# EAGLE design PRY234 (EAGLE 8.3.2)
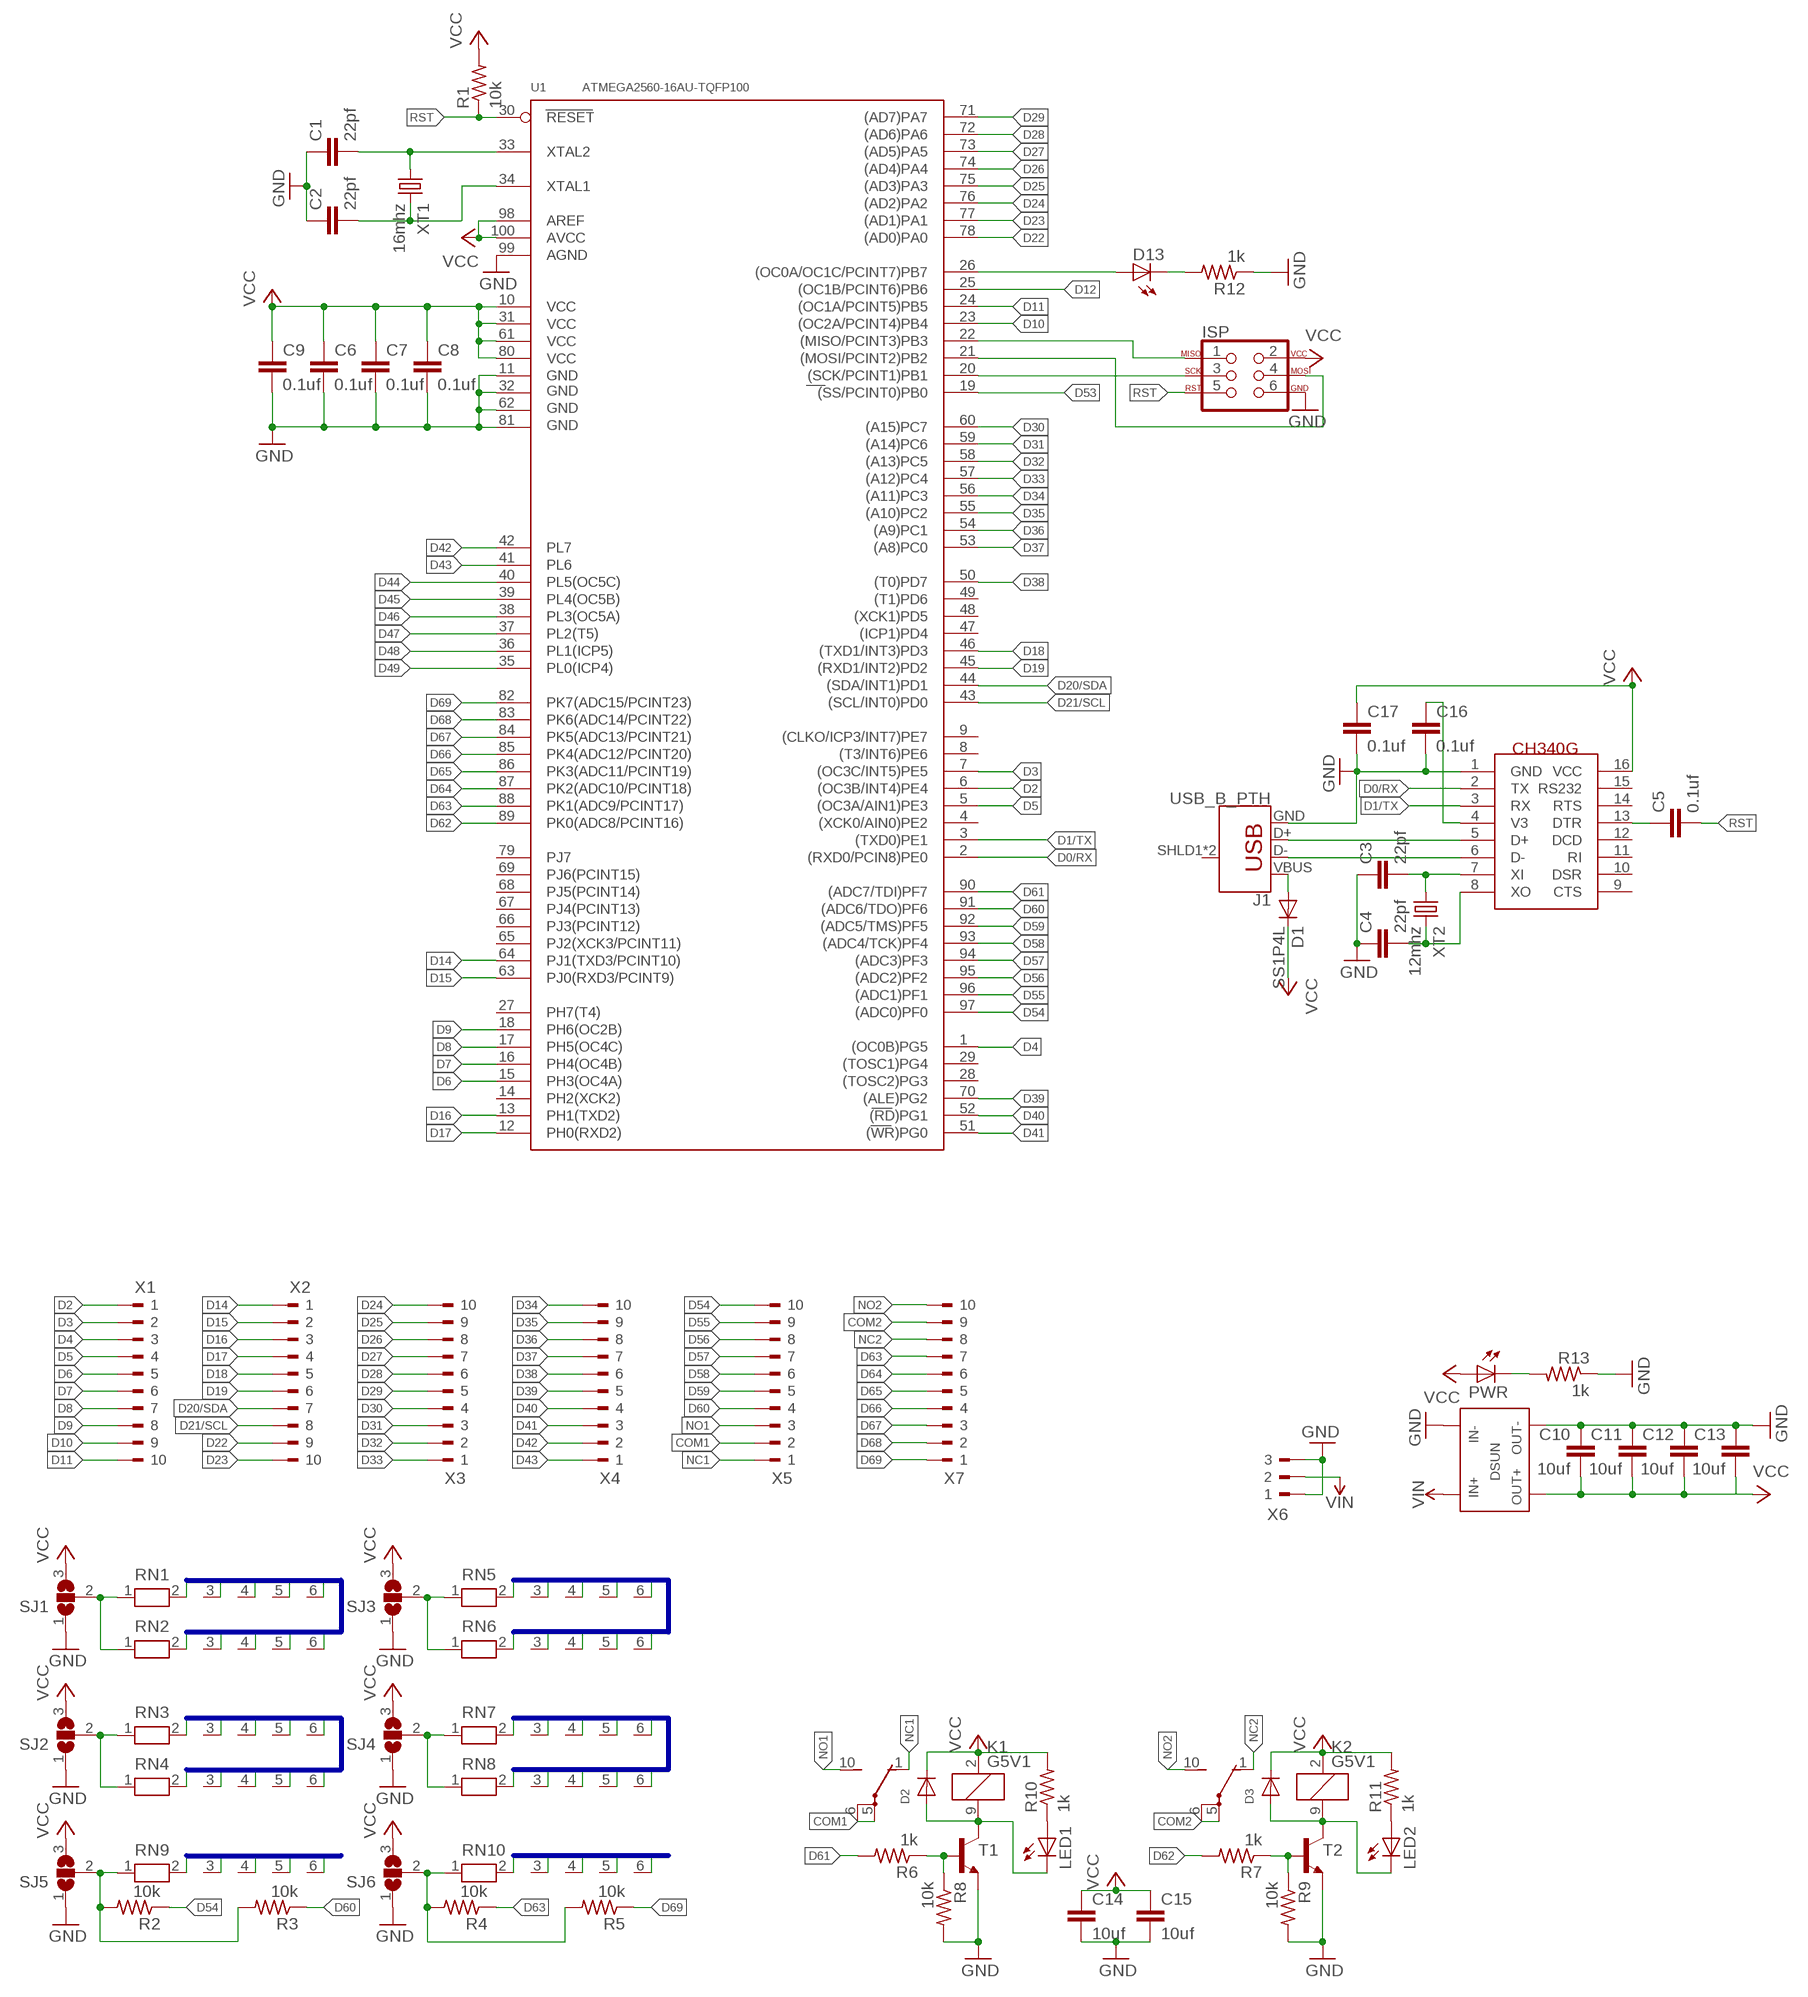
[diagram p0: schematic, sheet 1]

## Parts
C1  22pf  C-EUC0805  [C0805]
C2  22pf  C-EUC0805  [C0805]
C3  22pf  C-EUC0805  [C0805]
C4  22pf  C-EUC0805  [C0805]
C5  0.1uf  C-EUC0805  [C0805]
C6  0.1uf  C-EUC0805  [C0805]
C7  0.1uf  C-EUC0805  [C0805]
C8  0.1uf  C-EUC0805  [C0805]
C9  0.1uf  C-EUC0805  [C0805]
C10  10uf  C-EUC0805  [C0805]
C11  10uf  C-EUC0805  [C0805]
C12  10uf  C-EUC0805  [C0805]
C13  10uf  C-EUC0805  [C0805]
C14  10uf  C-EUC0805  [C0805]
C15  10uf  C-EUC0805  [C0805]
C16  0.1uf  C-EUC0805  [C0805]
C17  0.1uf  C-EUC0805  [C0805]
D1  SS1P4L  [DO220AAL]
D2  DIODESOD-323F  [SOD-323F]
D3  DIODESOD-323F  [SOD-323F]
D13  LEDCHIPLED_0805  [CHIPLED_0805]
ISP  AVR_SPI_PROG_3X2PTH  [2X3]
J1  USB_B_PTH  [USB-B-PTH]
K1  G5V1  [G5V1]
K2  G5V1  [G5V1]
LED1  LEDCHIPLED_0805  [CHIPLED_0805]
LED2  LEDCHIPLED_0805  [CHIPLED_0805]
PWR  LEDCHIPLED_0805  [CHIPLED_0805]
R1  10k  R-US_M0805  [M0805]
R2  10k  R-US_M0805  [M0805]
R3  10k  R-US_M0805  [M0805]
R4  10k  R-US_M0805  [M0805]
R5  10k  R-US_M0805  [M0805]
R6  1k  R-US_M0805  [M0805]
R7  1k  R-US_M0805  [M0805]
R8  10k  R-US_M0805  [M0805]
R9  10k  R-US_M0805  [M0805]
R10  1k  R-US_M0805  [M0805]
R11  1k  R-US_M0805  [M0805]
R12  1k  R-US_M0805  [M0805]
R13  1k  R-US_M0805  [M0805]
RN1  RN05  [RN-6]
RN2  RN05  [RN-6]
RN3  RN05  [RN-6]
RN4  RN05  [RN-6]
RN5  RN05  [RN-6]
RN6  RN05  [RN-6]
RN7  RN05  [RN-6]
RN8  RN05  [RN-6]
RN9  RN05  [RN-6]
RN10  RN05  [RN-6]
SJ1  SJ2W  [SJ_2]
SJ2  SJ2W  [SJ_2]
SJ3  SJ2W  [SJ_2]
SJ4  SJ2W  [SJ_2]
SJ5  SJ2W  [SJ_2]
SJ6  SJ2W  [SJ_2]
T1  MMBT2222ALT1-NPN-SOT23-BEC  [SOT23-BEC]
T2  MMBT2222ALT1-NPN-SOT23-BEC  [SOT23-BEC]
U1  ATMEGA2560-16AU-TQFP100  MCU-ATMEGA2560-16AU(TQFP100)  [TQFP100-0.5-14X14MM]
U$1  CH340G  [SOIC16]
U$3  DSUN  [DSUN]
X1  90-10  [90-10]
X2  90-10  [90-10]
X3  90-10  [90-10]
X4  90-10  [90-10]
X5  90-10  [90-10]
X6  90-3  [90-3]
X7  90-10  [90-10]
XT1  16mhz  XTAL7641  [XTAL7641]
XT2  12mhz  XTAL7641  [XTAL7641]

## Nets
COM1: K1.5(2:P) K1.6(2:P) X5.2
COM2: K2.5(2:P) K2.6(2:P) X7.9
D0/RX: U1.2((RXD0/PCIN8)PE0) U$1.2(TX)
D1/TX: U1.3((TXD0)PE1) U$1.3(RX)
D2: RN1.6 U1.6((OC3B/INT4)PE4) X1.1
D3: RN1.5 U1.7((OC3C/INT5)PE5) X1.2
D4: RN1.4 U1.1((OC0B)PG5) X1.3
D5: RN1.3 U1.5((OC3A/AIN1)PE3) X1.4
D6: RN1.2 U1.15(PH3(OC4A)) X1.5
D7: RN2.2 U1.16(PH4(OC4B)) X1.6
D8: RN2.3 U1.17(PH5(OC4C)) X1.7
D9: RN2.4 U1.18(PH6(OC2B)) X1.8
D10: RN2.5 U1.23((OC2A/PCINT4)PB4) X1.9
D11: RN2.6 U1.24((OC1A/PCINT5)PB5) X1.10
D12: U1.25((OC1B/PCINT6)PB6)
D14: RN3.6 U1.64(PJ1(TXD3/PCINT10)) X2.1
D15: RN3.5 U1.63(PJ0(RXD3/PCINT9)) X2.2
D16: RN3.4 U1.13(PH1(TXD2)) X2.3
D17: RN3.3 U1.12(PH0(RXD2)) X2.4
D18: RN3.2 U1.46((TXD1/INT3)PD3) X2.5
D19: RN4.2 U1.45((RXD1/INT2)PD2) X2.6
D20/SDA: RN4.3 U1.44((SDA/INT1)PD1) X2.7
D21/SCL: RN4.4 U1.43((SCL/INT0)PD0) X2.8
D22: RN4.5 U1.78((AD0)PA0) X2.9
D23: RN4.6 U1.77((AD1)PA1) X2.10
D24: RN5.6 U1.76((AD2)PA2) X3.10
D25: RN5.5 U1.75((AD3)PA3) X3.9
D26: RN5.4 U1.74((AD4)PA4) X3.8
D27: RN5.3 U1.73((AD5)PA5) X3.7
D28: RN5.2 U1.72((AD6)PA6) X3.6
D29: RN6.2 U1.71((AD7)PA7) X3.5
D30: RN6.3 U1.60((A15)PC7) X3.4
D31: RN6.4 U1.59((A14)PC6) X3.3
D32: RN6.5 U1.58((A13)PC5) X3.2
D33: RN6.6 U1.57((A12)PC4) X3.1
D34: RN7.6 U1.56((A11)PC3) X4.10
D35: RN7.5 U1.55((A10)PC2) X4.9
D36: RN7.4 U1.54((A9)PC1) X4.8
D37: RN7.3 U1.53((A8)PC0) X4.7
D38: RN7.2 U1.50((T0)PD7) X4.6
D39: RN8.2 U1.70((ALE)PG2) X4.5
D40: RN8.3 U1.52((RD)PG1) X4.4
D41: RN8.4 U1.51((WR)PG0) X4.3
D42: RN8.5 U1.42(PL7) X4.2
D43: RN8.6 U1.41(PL6) X4.1
D44: U1.40(PL5(OC5C))
D45: U1.39(PL4(OC5B))
D46: U1.38(PL3(OC5A))
D47: U1.37(PL2(T5))
D48: U1.36(PL1(ICP5))
D49: U1.35(PL0(ICP4))
D53: U1.19((SS/PCINT0)PB0)
D54: R2.1 U1.97((ADC0)PF0) X5.10
D55: RN9.6 U1.96((ADC1)PF1) X5.9
D56: RN9.5 U1.95((ADC2)PF2) X5.8
D57: RN9.4 U1.94((ADC3)PF3) X5.7
D58: RN9.3 U1.93((ADC4/TCK)PF4) X5.6
D59: RN9.2 U1.92((ADC5/TMS)PF5) X5.5
D60: R3.1 U1.91((ADC6/TDO)PF6) X5.4
D61: R6.2 U1.90((ADC7/TDI)PF7)
D62: R7.2 U1.89(PK0(ADC8/PCINT16))
D63: R4.1 U1.88(PK1(ADC9/PCINT17)) X7.7
D64: RN10.2 U1.87(PK2(ADC10/PCINT18)) X7.6
D65: RN10.3 U1.86(PK3(ADC11/PCINT19)) X7.5
D66: RN10.4 U1.85(PK4(ADC12/PCINT20)) X7.4
D67: RN10.5 U1.84(PK5(ADC13/PCINT21)) X7.3
D68: RN10.6 U1.83(PK6(ADC14/PCINT22)) X7.2
D69: R5.1 U1.82(PK7(ADC15/PCINT23)) X7.1
GND: C1.1 C2.1 C3.1 C4.1 C6.2 C7.2 C8.2 C9.2 C10.1 C11.1 C12.1 C13.1 C14.2 C15.2 C16.2 C17.2 ISP.6 J1.GND R8.2 R9.2 R12.1 R13.1 SJ1.1 SJ2.1 SJ3.1 SJ4.1 SJ5.1 SJ6.1 T1.E T2.E U1.11(GND) U1.32(GND1) U1.62(GND2) U1.81(GND3) U1.99(AGND) U$1.1(GND) U$3.IN-@1(IN-) U$3.OUT-@1(OUT-) X6.1 X6.3
MISO: ISP.1 U1.22((MISO/PCINT3)PB3)
MOSI: ISP.4 U1.21((MOSI/PCINT2)PB2)
N$5: J1.D+ U$1.5(D+)
N$6: RN1.1 RN2.1 SJ1.2
N$7: RN3.1 RN4.1 SJ2.2
N$8: J1.D- U$1.6(D-)
N$9: D1.P$2(A) J1.VBUS
N$10: RN5.1 RN6.1 SJ3.2
N$11: RN7.1 RN8.1 SJ4.2
N$12: C3.2 U$1.7(XI) XT2.1
N$13: C4.2 U$1.8(XO) XT2.2
N$14: C5.1 U$1.13(DTR)
N$15: C1.2 U1.33(XTAL2) XT1.1
N$16: C2.2 U1.34(XTAL1) XT1.2
N$17: D2.A K1.9 LED1.C T1.C
N$18: D3.A K2.9 LED2.C T2.C
N$19: R4.2 R5.2 RN10.1 SJ6.2
N$20: R2.2 R3.2 RN9.1 SJ5.2
N$21: LED1.A R10.1
N$22: R7.1 R9.1 T2.B
N$23: LED2.A R11.1
N$24: R6.1 R8.1 T1.B
N$25: D13.C R12.2
N$26: D13.A U1.26((OC0A/OC1C/PCINT7)PB7)
N$27: PWR.C R13.2
N$28: C16.1 U$1.4(V3)
NC1: K1.1(2:O) X5.1
NC2: K2.1(2:O) X7.8
NO1: K1.10(2:S) X5.3
NO2: K2.10(2:S) X7.10
RST: C5.2 ISP.5 R1.1 U1.30(RESET)
SCK: ISP.3 U1.20((SCK/PCINT1)PB1)
VCC: C6.1 C7.1 C8.1 C9.1 C10.2 C11.2 C12.2 C13.2 C14.1 C15.1 C17.1 D1.P$1(C) D2.C D3.C ISP.2 K1.2 K2.2 PWR.A R1.2 R10.2 R11.2 SJ1.3 SJ2.3 SJ3.3 SJ4.3 SJ5.3 SJ6.3 U1.10(VCC) U1.31(VCC1) U1.61(VCC2) U1.80(VCC3) U1.98(AREF) U1.100(AVCC) U$1.16(VCC) U$3.OUT+@2(OUT+)
VIN: U$3.IN+@2(IN+) X6.2
Unconnected: J1.SHLD1(SHIELD) J1.SHLD2(SHIELD) U1.4((XCK0/AIN0)PE2) U1.8((T3/INT6)PE6) U1.9((CLKO/ICP3/INT7)PE7) U1.14(PH2(XCK2)) U1.27(PH7(T4)) U1.28((TOSC2)PG3) U1.29((TOSC1)PG4) U1.47((ICP1)PD4) U1.48((XCK1)PD5) U1.49((T1)PD6) U1.65(PJ2(XCK3/PCINT11)) U1.66(PJ3(PCINT12)) U1.67(PJ4(PCINT13)) U1.68(PJ5(PCINT14)) U1.69(PJ6(PCINT15)) U1.79(PJ7) U$1.9(CTS) U$1.10(DSR) U$1.11(RI) U$1.12(DCD) U$1.14(RTS) U$1.15(RS232)

## Buses
D[2..11]
D[14..23]
D[24..33]
D[34..43]
D[54..69]

## Library data of the parts
C1-C17 = rcl:C-EU: CAPACITOR, European symbol
D1 = Meidin.mx:SS1P4L
D2 D3 = adafruit:DIODE: Diode SMADIODE - SMA Surface Mount Package 20V 1A Schottky Diode Digikey: 641-1014-6-ND DO-1N4148 - Through Hole Small Current Diode SOD-123 20V 1 A (.5mV Vf) Schottky Diode - Digikey: MBRX120TPMSCT-ND SOD-323 10V 570mA (.38mV Vf, 3ns) Schottky Diode - Digikey: ZLLS410CT-ND SOD-523 30V 30mA Schottky Diode (RB751S-40TE61) - Digikey: RB751S-40TE61CT-ND SOT23-R/W - SOT23 Package (R = Solder Paste/Reflow Ovens, W = Hand-Soldering) BAT54Film 40V 300mA - Digikey: 497-7162-1-ND
D13 LED1 LED2 PWR = led:LED: LED OSRAM: - CHIPLED LG R971, LG N971, LY N971, LG Q971, LY Q971, LO R971, LY R971 LH N974, LH R974 LS Q976, LO Q976, LY Q976 LO Q996 - Hyper CHIPLED LW Q18S LB Q993, LB Q99A, LB R99A - SideLED LS A670, LO A670, LY A670, LG A670, LP A670 LB A673, LV A673, LT A673, LW A673 LH A674 LY A675 LS A676, LA A676, LO A676, LY A676, LW A676 LS A679, LY A679, LG A679 - Hyper Micro SIDELED® LS Y876, LA Y876, LO Y876, LY Y876 LT Y87S - SmartLED LW L88C, LW L88S LB L89C, LB L89S, LG L890 LS L89K, LO L89K, LY L89K LS L896, LA L896, LO L896, LY L896 - TOPLED LS T670, LO T670, LY T670, LG T670, LP T670 LSG T670, LSP T670, LSY T670, LOP T670, LYG T670 LG T671, LOG T671, LSG T671 LB T673, LV T673, LT T673, LW T673 LH T674 LS T676, LA T676, LO T676, LY T676, LB T676, LH T676, LSB T676, LW T676 LB T67C, LV T67C, LT T67C, LS T67K, LO T67K, LY T67K, LW E67C LS E67B, LA E67B, LO E67B, LY E67B, LB E67C, LV E67C, LT E67C LW T67C LS T679, LY T679, LG T679 LS T770, LO T770, LY T770, LG T770, LP T770 LB T773, LV T773, LT T773, LW T773 LH T774 LS E675, LA E675, LY E675, LS T675 LS T776, LA T776, LO T776, LY T776, LB T776 LHGB T686 LT T68C, LB T68C - Hyper Mini TOPLED® LB M676 - Mini TOPLED Santana® LG M470 LS M47K, LO M47K, LY M47K Source: http://www.osram.convergy.de LUXEON: - LUMILED® LXK2-PW12-R00, LXK2-PW12-S00, LXK2-PW14-U00, LXK2-PW14-V00 LXK2-PM12-R00, LXK2-PM12-S00, LXK2-PM14-U00 LXK2-PE12-Q00, LXK2-PE12-R00, LXK2-PE12-S00, LXK2-PE14-T00, LXK2-PE14-U00 LXK2-PB12-K00, LXK2-PB12-L00, LXK2-PB12-M00, LXK2-PB14-N00, LXK2-PB14-P00, LXK2-PB14-Q00 LXK2-PR12-L00, LXK2-PR12-M00, LXK2-PR14-Q00, LXK2-PR14-R00 LXK2-PD12-Q00, LXK2-PD12-R00, LXK2-PD12-S00 LXK2-PH12-R00, LXK2-PH12-S00 LXK2-PL12-P00, LXK2-PL12-Q00, LXK2-PL12-R00 Source: www.luxeon.com KINGBRIGHT: KA-3528ASYC Source: www.kingbright.com
ISP = SparkFun-Connectors:AVR_SPI_PROG_3X2: AVR ISP 6 Pin This is the reduced ISP connector for AVR programming. Common on Arduino. This footprint will take up less PCB space and can be used with a 10-pin to 6-pin adapter such as SKU: BOB-08508 **Special note about "TEST_POINT" package. The stop mask is on the top side, so if you want your programming test points to be on the bottom of your board, make sure to place this package on the bottom side of the board. This also ensure that the orientation to program from the bottom side will be correct. SparkFun Products: SparkFun ISP Pogo Adapter <https://www.sparkfun.com/products/11591> - NS Tiny AVR Programmer <https://www.sparkfun.com/products/11801> -PTH
J1 = SparkFun-Connectors:USB_B: USB Type B Connector SparkFun Products: SparkFun Stepoko <https://www.sparkfun.com/products/13899> PTH; PROD_ID: CONN-08278; SF_ID: PRT-00139
K1 K2 = relay:G5V1: RELAY 1 x switch, 0.5 A/125 V AC, 1 A/24 V DC , Omron; MPN: G5V-1-DC24; OC_FARNELL: 9949593; OC_NEWARK: 36M6377
R1-R13 = rcl:R-US_: RESISTOR, American symbol
RN1-RN10 = resistor-net:RN05: RESISTOR NETWORK; OC_FARNELL: unknown; OC_NEWARK: unknown
SJ1-SJ6 = jumper:SJ2W: SMD solder JUMPER
T1 T2 = transistor:*-NPN-: NPN Transistror BF959 corrected 2008.03.06
U1 = Seeed-IC:MCU-ATMEGA2560-16AU(TQFP100): 310010006; MPN: ATMEGA2560-16AU
U$1 = usb-serial:CH340G
U$3 = Meidin.mx:DSUN
X1-X5 X7 = con-weidmueller-sl35:90-10: WEIDMUELLER CLAMP CONNECTOR; OC_FARNELL: unknown; OC_NEWARK: unknown
X6 = con-weidmueller-sl35:90-3: WEIDMUELLER CLAMP CONNECTOR; OC_FARNELL: unknown; OC_NEWARK: unknown
XT1 XT2 = Meidin.mx:XTAL

## Board
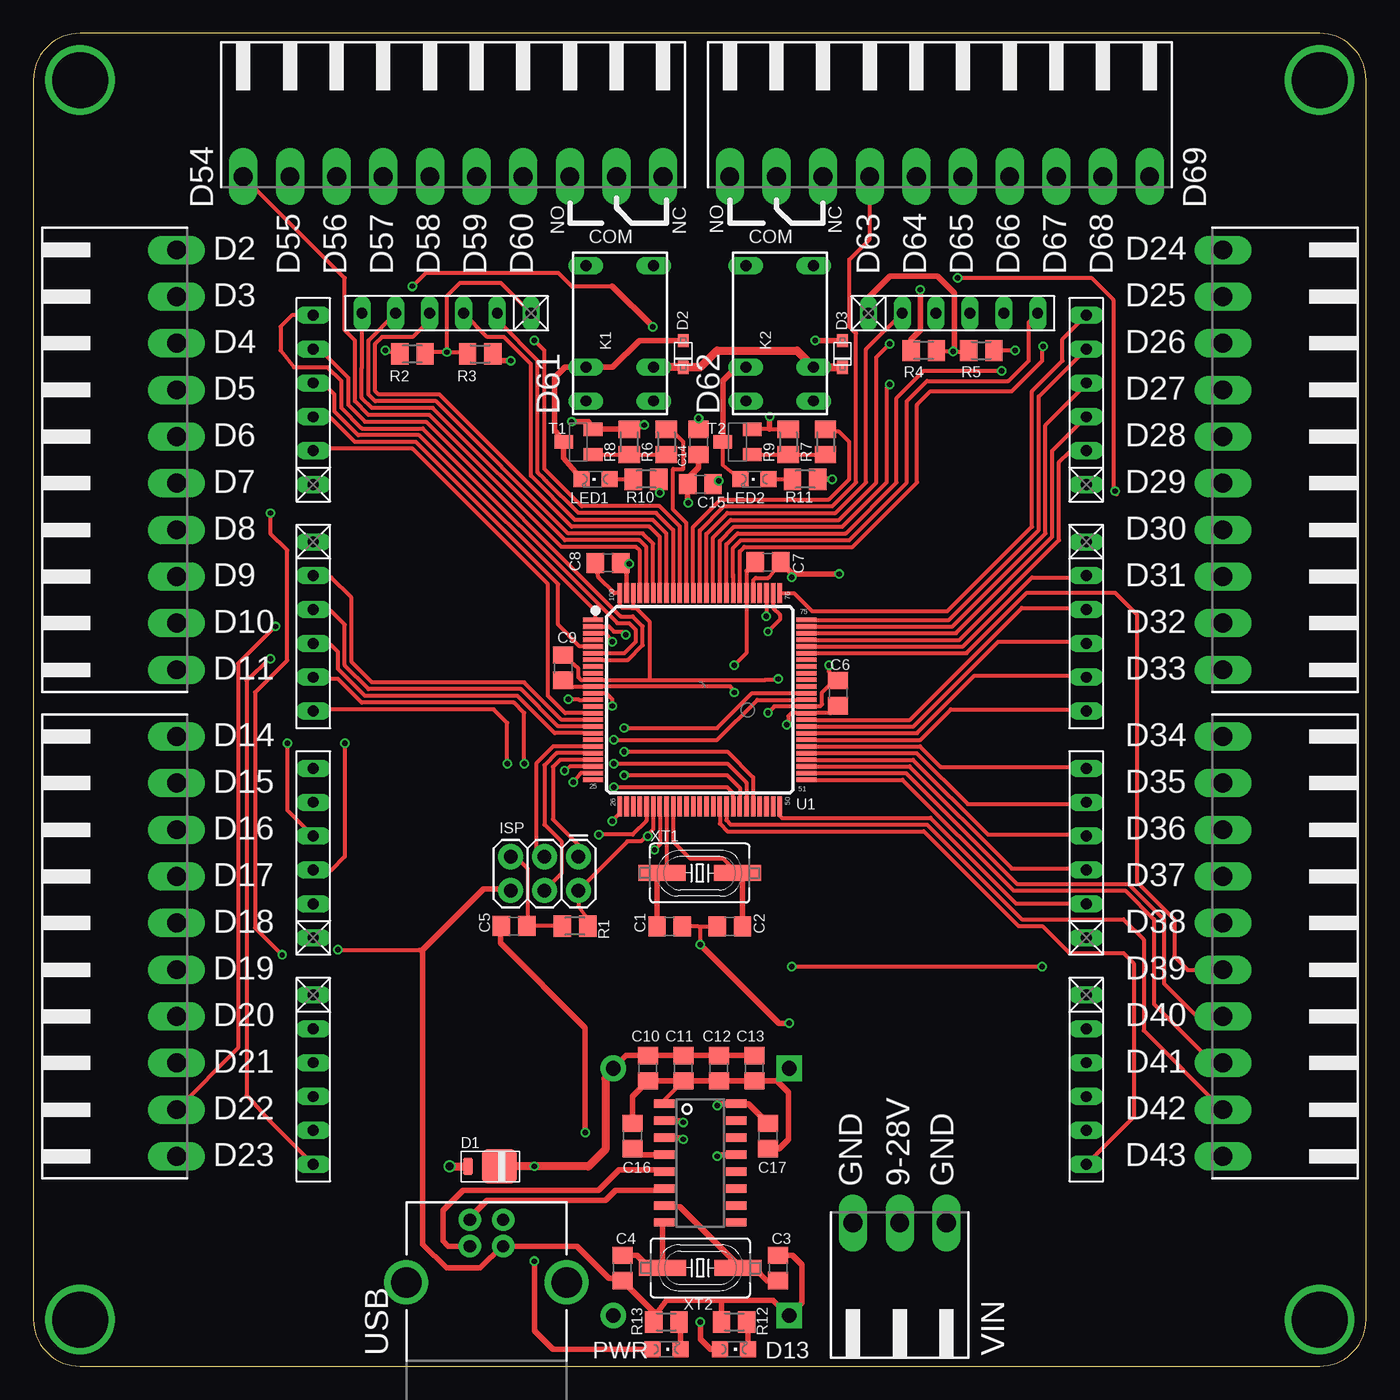
[diagram p1: board, top side]
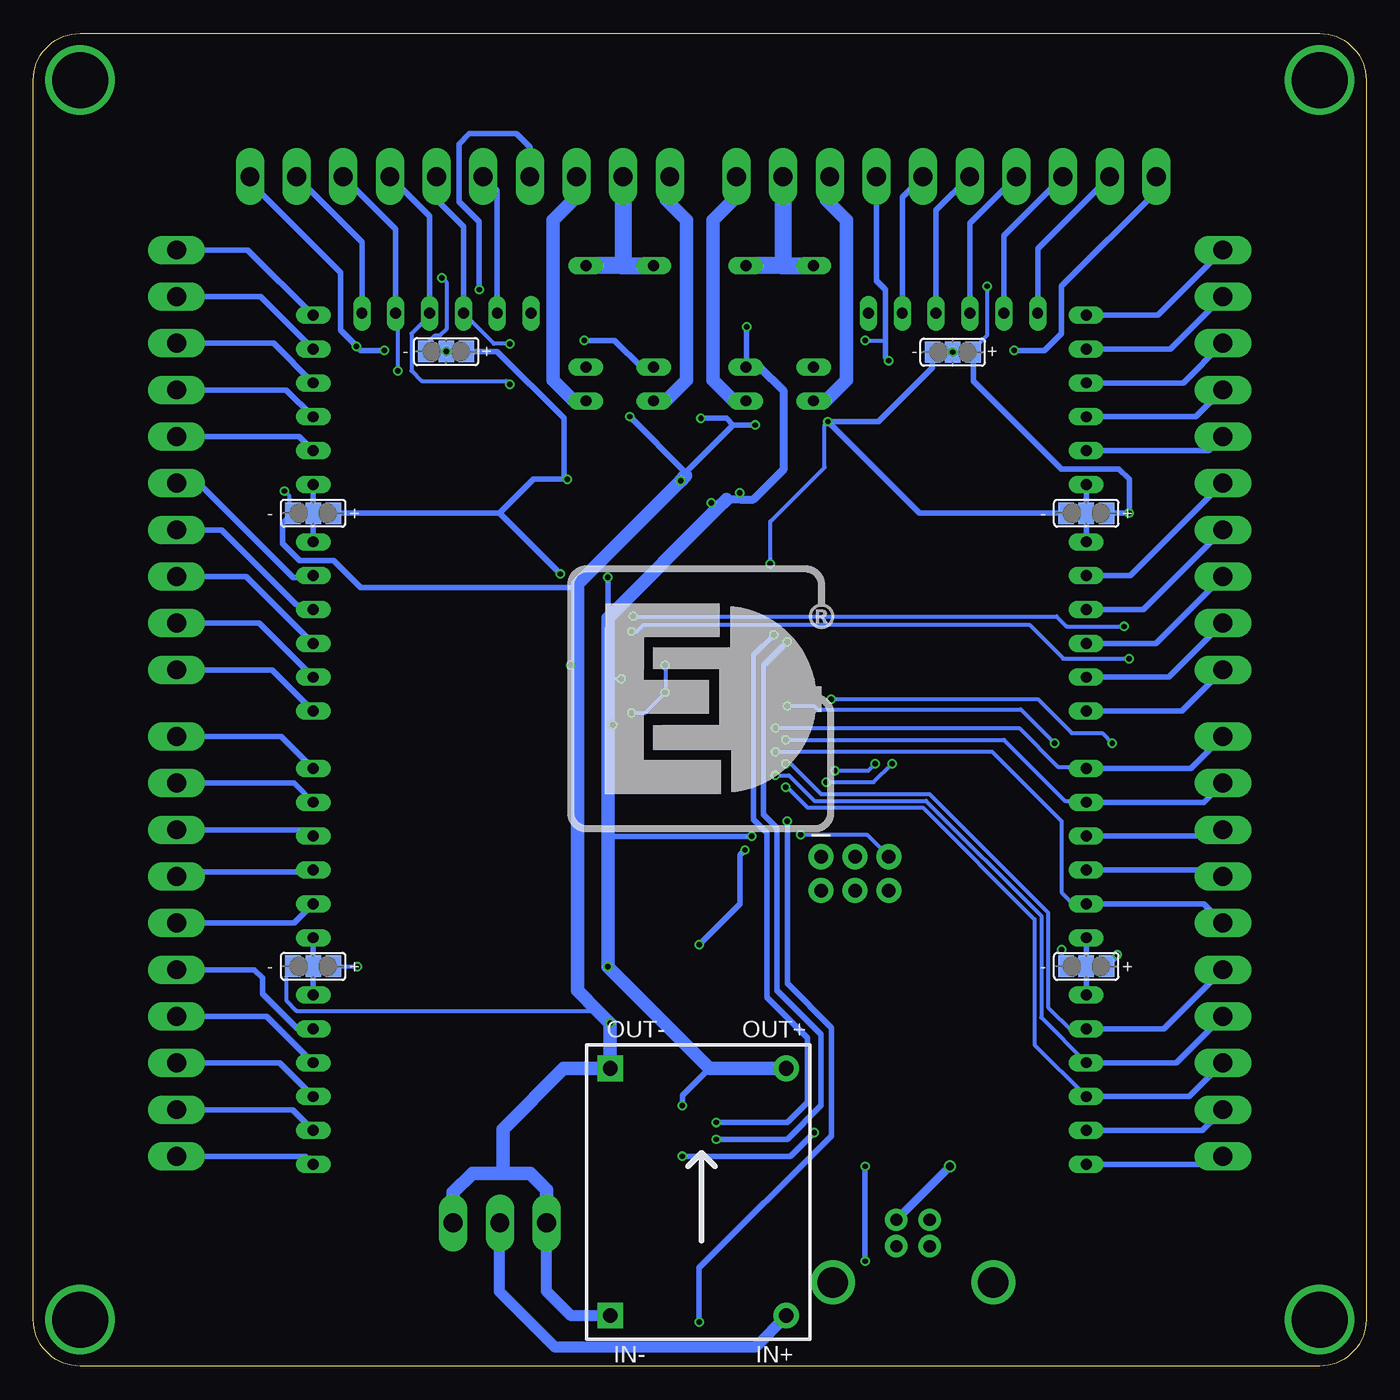
[diagram p2: board, bottom side, seen from below]

Size 100 x 100 mm. Coordinates in mm from the lower left corner, seen from the top.
Outline: 100,3.5 100,96.5 arc90 96.5,100 3.5,100 arc90 0,96.5 0,3.5 arc90 3.5,0 96.5,0 arc90 100,3.5
Copper layers (1*16): Top 0.035mm / dielectric 1.5mm / Bottom 0.035mm
Design rules "RYSPEE_2layer_DRU": minimum track width 6mil, minimum drill 12mil, track to track 6mil, track to pad 6mil, pad to pad 6mil, via to via 6mil, smd to smd 0mil, copper to edge 10mil, drill to drill 10mil, minimum pad ring 10mil, minimum via ring 6mil, stop-mask expansion 2mil, vias tented up to drill 100mil, thermal gap 10mil

### Footprints (pad centres in the part's own frame; a part is rotated, then mirrored left to right if it is on the bottom)
C0805 = smd 1.3 x 1.5: 1 -0.95,0; 2 0.95,0
DO220AAL = smd 2.667 x 2.54: P$1 -0.572,0 | smd 0.762 x 1.27: P$2 1.778,0
SOD-323F = smd 1 x 0.8: A -1,0; C 1,0
CHIPLED_0805 = smd 1.2 x 1.2: A 0,-1.05; C 0,1.05
2X3 = drill 1.016 pad 1.88: 1 0,0; 2 0,2.54; 3 2.54,0; 4 2.54,2.54; 5 5.08,0; 6 5.08,2.54
USB-B-PTH = drill 0.914 pad 1.676: D+ 4,1.25; D- 5.981,1.25; GND 4,-1.25; VBUS 5.981,-1.25 | drill 2.286: SHLD1 1.282,-6.02; SHLD2 1.282,6.02
G5V1 = drill 0.813 long: 1 -5.08,-2.54; 2 -2.54,-2.54; 5 5.08,-2.54; 6 5.08,2.54; 9 -2.54,2.54; 10 -5.08,2.54
M0805 = smd 1.3 x 1.6: 1 -0.95,0; 2 0.95,0
RN-6 = drill 0.813 long: 1 -6.35,0; 2 -3.81,0; 3 -1.27,0; 4 1.27,0; 5 3.81,0; 6 6.35,0
SJ_2 = smd 1.168 x 1.6: 1 -1.524,0; 2 0,0; 3 1.524,0
SOT23-BEC = smd 1 x 1.4: B -0.95,-1.1; C 0,1.1; E 0.95,-1.1
TQFP100-0.5-14X14MM = smd 1.5 x 0.35: 1 -8,6; 2 -8,5.5; 3 -8,5; 4 -8,4.5; 5 -8,4; 6 -8,3.5; 7 -8,3; 8 -8,2.5; 9 -8,2; 10 -8,1.5; 11 -8,1; 12 -8,0.5; 13 -8,0; 14 -8,-0.5; 15 -8,-1; 16 -8,-1.5; 17 -8,-2; 18 -8,-2.5; 19 -8,-3; 20 -8,-3.5; 21 -8,-4; 22 -8,-4.5; 23 -8,-5; 24 -8,-5.5; 25 -8,-6; 51 8,-6; 52 8,-5.5; 53 8,-5; 54 8,-4.5; 55 8,-4; 56 8,-3.5; 57 8,-3; 58 8,-2.5; 59 8,-2; 60 8,-1.5; 61 8,-1; 62 8,-0.5; 63 8,0; 64 8,0.5; 65 8,1; 66 8,1.5; 67 8,2; 68 8,2.5; 69 8,3; 70 8,3.5; 71 8,4; 72 8,4.5; 73 8,5; 74 8,5.5; 75 8,6 | smd 0.35 x 1.5: 26 -6,-8; 27 -5.5,-8; 28 -5,-8; 29 -4.5,-8; 30 -4,-8; 31 -3.5,-8; 32 -3,-8; 33 -2.5,-8; 34 -2,-8; 35 -1.5,-8; 36 -1,-8; 37 -0.5,-8; 38 0,-8; 39 0.5,-8; 40 1,-8; 41 1.5,-8; 42 2,-8; 43 2.5,-8; 44 3,-8; 45 3.5,-8; 46 4,-8; 47 4.5,-8; 48 5,-8; 49 5.5,-8; 50 6,-8; 76 6,8; 77 5.5,8; 78 5,8; 79 4.5,8; 80 4,8; 81 3.5,8; 82 3,8; 83 2.5,8; 84 2,8; 85 1.5,8; 86 1,8; 87 0.5,8; 88 0,8; 89 -0.5,8; 90 -1,8; 91 -1.5,8; 92 -2,8; 93 -2.5,8; 94 -3,8; 95 -3.5,8; 96 -4,8; 97 -4.5,8; 98 -5,8; 99 -5.5,8; 100 -6,8
SOIC16 = smd 0.635 x 1.524: 1 -4.445,-2.695; 2 -3.175,-2.695; 3 -1.905,-2.695; 4 -0.635,-2.695; 5 0.635,-2.695; 6 1.905,-2.695; 7 3.175,-2.695; 8 4.445,-2.695; 9 4.445,2.695; 10 3.175,2.695; 11 1.905,2.695; 12 0.635,2.695; 13 -0.635,2.695; 14 -1.905,2.695; 15 -3.175,2.695; 16 -4.445,2.695
DSUN = drill 1.1 pad 1.93: IN+@2 14.986,1.778; OUT+@2 14.986,20.32 | drill 1.1 pad 1.93 square: IN-@1 1.778,1.778; OUT-@1 1.778,20.32
90-10 = drill 1.422 long: 1 -15.75,5.25; 2 -12.25,5.25; 3 -8.75,5.25; 4 -5.25,5.25; 5 -1.75,5.25; 6 1.75,5.25; 7 5.25,5.25; 8 8.75,5.25; 9 12.25,5.25; 10 15.75,5.25
90-3 = drill 1.422 long: 1 -3.5,5.25; 2 0,5.25; 3 3.5,5.25
XTAL7641 = smd 3.5 x 1.2: 1 -2.826,0; 2 2.826,0

### Placement (x,y rotation side)
C1  47.75,32.99 180 top
C2  52.25,32.99 0 top
C3  55.88,7.37 270 top
C4  44.2,7.37 90 top
C5  36.07,33.02 0 top
C6  60.38,50.49 90 top
C7  55.12,60.33 180 top
C8  43.11,60.27 0 top
C9  39.76,52.4 270 top
C10  46.1,22.35 90 top
C11  48.77,22.35 90 top
C12  51.44,22.35 90 top
C13  54.1,22.35 90 top
C14  49.91,69.34 90 top
C15  50.04,66.17 0 top
C16  44.96,17.27 90 top
C17  55.12,17.27 270 top
D1  34.39,14.99 180 top
D2  48.77,75.95 270 top
D3  60.71,75.95 270 top
D13  52.58,1.27 270 top
ISP  40.89,38.23 180 top
J1  34,5 90 top
K1  44,77.5 90 top
K2  56,77.5 90 top
LED1  42.16,66.55 90 top
LED2  54.1,66.55 90 top
PWR  47.5,1.27 270 top
R1  40.64,33.02 0 top
R2  28.45,75.95 0 top
R3  33.53,75.95 180 top
R4  66.8,76.2 0 top
R5  71.12,76.2 180 top
R6  47.5,69.34 90 top
R7  59.44,69.34 90 top
R8  44.7,69.34 90 top
R9  56.64,69.34 90 top
R10  45.97,66.55 0 top
R11  57.91,66.55 0 top
R12  52.58,3.3 0 top
R13  47.5,3.3 0 top
RN1  21,72.5 90 top
RN2  21,55.5 270 top
RN3  21,38.5 90 top
RN4  21,21.5 270 top
RN5  79,72.5 90 top
RN6  79,55.5 270 top
RN7  79,38.5 90 top
RN8  79,21.5 270 top
RN9  31,79 180 top
RN10  69,79 0 top
SJ1  21,64 0 bottom
SJ2  21,30 0 bottom
SJ3  79,64 0 bottom
SJ4  79,30 0 bottom
SJ5  31.02,76.08 0 bottom
SJ6  69.02,76.13 0 bottom
T1  40.89,69.34 90 top
T2  52.83,69.34 90 top
U1  50,50 0 top
U$1  50.04,15.24 270 top
U$3  58.5,2.02 0 bottom
X1  5.5,68 270 top
X2  5.5,31.5 270 top
X3  94.5,68 90 top
X4  94.5,31.5 90 top
X5  31.5,94.5 180 top
X6  65,5.5 0 top
X7  68,94.5 180 top
XT1  50,37 0 top
XT2  50.04,7.37 180 top

### Tracks (layer width: path | path; a pad name or v marks a point on that pad's centre or on a via)
COM1
  Bottom 1.27: 43.94,82.58 K1.6 | 43.94,82.58 K1.5 | X5.2 43.75,82.77 43.94,82.58
COM2
  Bottom 1.27: 56,82.58 K2.6 | 56,82.58 K2.5 | X7.9 55.75,82.83 56,82.58
D0/RX  (via drill 0.4)
  Top 0.305: U1.2 43.05,55.5 43.18,55.5 43.56,55.12 44.2,55.12 v44.45,54.86
  Top 0.406: U$1.2 48.64,18.41 v48.77,18.29
  Bottom 0.406: v44.45,54.86 45.97,53.34 45.97,41.02 44.96,40.01 44.96,27.69 41.91,24.64 41.91,19.81 43.43,18.29 v48.77,18.29
D1/TX  (via drill 0.4)
  Top 0.305: U1.3 42.94,55 v43.43,54.36
  Top 0.406: U$1.3 48.64,17.14 v48.77,17.02
  Bottom 0.406: v43.43,54.36 45.21,52.58 45.21,41.4 44.2,40.39 44.2,28.19 40.89,24.89 40.89,19.56 43.43,17.02 v48.77,17.02
D2
  Top 0.305: RN1.6 19.41,78.85 18.54,77.98 18.54,76.2 19.56,74.93 22.1,74.93 23.11,73.91 23.11,71.88 24.64,70.36 29.21,70.36 43.81,55.75 44.7,55.75 45.21,55.24 45.21,54.36 44.36,53.5 U1.6
  Bottom 0.406: RN1.6 15.65,78.85 X1.1
D3
  Top 0.305: RN1.5 21.48,76.31 23.62,74.17 23.62,72.14 24.89,70.87 29.46,70.87 44.07,56.26 44.96,56.26 45.72,55.5 45.72,54.1 44.62,53 U1.7
  Bottom 0.406: RN1.5 14.69,76.31 X1.2
D4
  Top 0.305: U1.1 42.16,56.16 42.16,56.64 28.96,69.85 24.38,69.85 22.61,71.63 22.61,72.9 21.84,73.66 21.11,73.66 RN1.4
  Bottom 0.406: RN1.4 13.73,73.77 X1.3
D5
  Top 0.305: U1.5 41,54 39.37,55.63 39.37,58.67 28.7,69.34 24.13,69.34 22.35,71.12 21.11,71.12 RN1.3
  Bottom 0.406: RN1.3 12.77,71.23 X1.4
D6
  Top 0.305: 41.98,49.02 U1.15 39.9,49 38.61,50.29 38.61,58.67 28.45,68.83 21.14,68.83 RN1.2
  Bottom 0.406: RN1.2 11.81,68.69 X1.5
D7
  Top 0.305: U1.16 39.64,48.5 36.83,51.31 25.4,51.31 23.88,52.83 23.88,57.66 22.35,59.18 21.13,59.18 RN2.2
  Bottom 0.406: RN2.2 17.69,59.31 X1.6
D8
  Top 0.305: U1.17 39.38,48 36.58,50.8 25.15,50.8 23.37,52.58 23.37,55.63 22.35,56.64 21.13,56.64 RN2.3
  Bottom 0.406: RN2.3 16.73,56.77 X1.7
D9
  Top 0.305: U1.18 39.11,47.5 36.32,50.29 24.89,50.29 22.86,52.32 22.86,53.59 22.35,54.1 21.13,54.1 RN2.4
  Bottom 0.406: RN2.4 15.77,54.23 X1.8
D10  (via drill 0.4)
  Top 0.305: 20.87,51.56 22.86,51.56 24.64,49.78 36.07,49.78 36.83,49.02 v36.83,45.21 | 20.32,51.56 20.87,51.56 | 20.87,51.56 RN2.5 | v39.86,44.68 40.3,45 U1.23
  Bottom 0.305: v39.86,44.68 37.36,44.68 v36.83,45.21
  Bottom 0.406: RN2.5 14.81,51.69 X1.9
D11  (via drill 0.4)
  Top 0.305: RN2.6 21.13,49.28 34.54,49.28 35.56,48.26 v35.56,45.21 | U1.24 41.07,44.5 v40.51,43.81
  Bottom 0.305: v40.51,43.81 36.96,43.81 v35.56,45.21
  Bottom 0.406: RN2.6 13.85,49.15 X1.10
D14  (via drill 0.4)
  Top 0.305: U1.64 53.93,50.5 51.31,47.88 v44.32,47.88
  Bottom 0.305: v44.32,47.88 26.04,47.88 23.11,44.96 21.11,44.96 RN3.6
  Bottom 0.406: RN3.6 13.15,44.85 X2.1
D15  (via drill 0.4)
  Top 0.305: U1.63 54.32,50 51.31,46.99 v43.56,46.99
  Bottom 0.305: v43.56,46.99 27.18,46.99 22.61,42.42 21.11,42.42 RN3.5
  Bottom 0.406: RN3.5 12.19,42.31 X2.2
D16  (via drill 0.4)
  Top 0.305: U1.13 40.93,50 40.89,50.04 v40.13,50.04 | v19.05,46.74 19.05,41.72 RN3.4
  Bottom 0.305: v40.13,50.04 24.64,50.04 22.1,47.5 19.81,47.5 v19.05,46.74
  Bottom 0.406: RN3.4 11.23,39.77 X2.3
D17  (via drill 0.4)
  Top 0.305: U1.12 42.97,50.5 43.43,50.04 v43.43,49.53 | v23.37,46.74 23.37,38.23 22.35,37.21 21.02,37.21 RN3.3
  Bottom 0.305: v43.43,49.53 41.4,49.53 41.15,49.28 25.91,49.28 v23.37,46.74
  Bottom 0.406: RN3.3 11.23,37.23 X2.4
D18  (via drill 0.4)
  Top 0.305: U1.46 54,44.17 52.07,46.1 v44.32,46.1
  Bottom 0.305: 21,34.72 RN3.2 21.15,34.54 21.84,34.54 22.86,35.56 22.86,40.89 28.07,46.1 v44.32,46.1
  Bottom 0.406: RN3.2 12.19,34.69 X2.5
D19  (via drill 0.4)
  Top 0.305: U1.45 53.5,43.78 52.07,45.21 v43.56,45.21
  Bottom 0.305: v43.56,45.21 43.18,45.21 40.89,42.93 32.77,42.93 23.88,34.04 23.88,26.92 22.1,25.15 21.16,25.15 RN4.2
  Bottom 0.406: RN4.2 15.19,25.31 X2.6
D20/SDA  (via drill 0.4)
  Top 0.305: U1.44 53,43.39 52.07,44.32 v44.32,44.32
  Bottom 0.305: v44.32,44.32 43.31,44.32 41.4,42.42 33.02,42.42 24.38,33.78 24.38,26.15 RN4.3
  Bottom 0.406: RN4.3 14.23,22.77 X2.7
D21/SCL  (via drill 0.4)
  Top 0.305: U1.43 52.5,43 52.07,43.43 v43.56,43.43
  Bottom 0.305: v43.56,43.43 43.43,43.43 41.91,41.91 33.27,41.91 24.89,33.53 24.89,24.12 RN4.4
  Bottom 0.406: RN4.4 13.27,20.23 X2.8
D22  (via drill 0.4)
  Top 0.305: U1.78 v55,56.27 v54.99,56.26 | X2.9 15.37,23.87 15.37,52.7 v18.16,55.5
  Bottom 0.305: v54.99,56.26 23.24,56.26 22.48,55.5 v18.16,55.5
  Bottom 0.406: RN4.5 12.31,17.69 X2.9
D23  (via drill 0.4)
  Top 0.305: U1.77 55.5,56.9 56.01,56.39 56.01,56.01 v55.12,55.12 | RN4.6 17.78,18.37 16.51,19.81 16,20.32 16,51.44 v17.78,53.09
  Bottom 0.305: v55.12,55.12 54.74,55.12 54.23,55.63 25.27,55.63 22.73,53.09 v17.78,53.09
  Bottom 0.406: RN4.6 11.35,15.15 X2.10
D24
  Top 0.305: U1.76 57.06,58 58.42,56.64 68.58,56.64 74.93,62.99 74.93,73.15 77.22,75.44 77.22,77.07 78.94,78.79 | 77.98,78.74 78.89,78.74 78.94,78.79 | 78.94,78.79 RN5.6
  Bottom 0.406: X3.10 83.9,83.75 RN5.6
D25
  Top 0.305: U1.75 68.7,56 75.44,62.74 75.44,72.75 RN5.5 78.89,76.2 77.98,76.2
  Bottom 0.406: X3.9 82.94,80.25 RN5.5
D26
  Top 0.305: U1.74 68.96,55.5 75.95,62.48 75.95,70.61 78.89,73.56 78.89,73.66 RN5.4
  Bottom 0.406: X3.8 81.98,76.75 RN5.4
D27
  Top 0.305: U1.73 69.22,55 76.45,62.23 76.45,68.68 RN5.3 78.89,71.12
  Bottom 0.406: X3.7 81.02,73.25 RN5.3
D28
  Top 0.305: U1.72 69.49,54.5 76.96,61.98 76.96,67.82 77.72,68.58 78.89,68.58 RN5.2
  Bottom 0.406: X3.6 80.06,69.75 RN5.2
D29
  Top 0.305: U1.71 69.75,54 74.93,59.18 78.87,59.18 RN6.2
  Bottom 0.406: X3.5 87.59,66.25 80.52,59.18 79.13,59.18 RN6.2
D30
  Top 0.305: U1.60 65.77,48.5 74.17,56.9 78.87,56.9 RN6.3
  Bottom 0.406: X3.4 85.86,62.75 80.26,57.15 79.25,57.02 RN6.3
D31
  Top 0.305: U1.59 66.03,48 72.39,54.36 78.87,54.36 RN6.4
  Bottom 0.406: X3.3 84.02,59.25 RN6.4
D32
  Top 0.305: U1.58 66.3,47.5 70.61,51.82 78.87,51.82 RN6.5
  Bottom 0.406: X3.2 83.06,55.75 RN6.5
D33
  Top 0.305: U1.57 66.56,47 68.83,49.28 78.87,49.28 RN6.6
  Bottom 0.406: X3.1 82.1,52.25 RN6.6
D34
  Top 0.305: U1.56 66.53,46.5 68.07,44.96 78.89,44.96 RN7.6
  Bottom 0.406: X4.10 81.4,47.25 RN7.6
D35
  Top 0.305: U1.55 66.27,46 70.1,42.16 78.85,42.16 RN7.5
  Bottom 0.406: X4.9 80.44,43.75 RN7.5
D36
  Top 0.305: U1.54 66.01,45.5 71.63,39.88 78.89,39.88 RN7.4
  Bottom 0.406: X4.8 79.48,40.25 RN7.4
D37
  Top 0.305: U1.53 65.74,45 73.41,37.34 78.89,37.34 RN7.3
  Bottom 0.406: X4.7 88.22,36.75 87.88,37.08 79.15,37.08 RN7.3
D38
  Top 0.305: RN7.2 73.77,34.69 67.31,41.15 56.13,41.15 56,41.28 U1.50
  Bottom 0.406: X4.6 80.44,33.25 RN7.2
D39
  Top 0.305: U1.70 70.01,53.5 74.55,58.04 81.15,58.04 82.8,56.39 82.8,36.32 85.6,33.53 85.6,30.73 86.61,29.72 89.22,29.72 X4.5
  Bottom 0.406: X4.5 83.44,29.75 82.8,29.11 82.8,27.94 80.17,25.31 RN8.2
D40
  Top 0.305: U1.52 65.48,44.5 73.79,36.2 82.17,36.2 84.84,33.53 84.84,28.7 87.38,26.16 89.16,26.16 X4.4
  Bottom 0.406: X4.4 82.48,26.25 RN8.3
D41
  Top 0.305: U1.51 65.22,44 73.53,35.69 81.92,35.69 84.07,33.53 84.07,27.18 88.65,22.61 89.11,22.61 X4.3
  Bottom 0.406: X4.3 81.52,22.75 RN8.4
D42
  Top 0.305: U1.42 52,40.96 52.32,40.64 67.06,40.64 74.17,33.53 81.79,33.53 83.31,32 83.31,25.19 X4.2
  Bottom 0.406: X4.2 80.56,19.25 RN8.5
D43
  Top 0.305: U1.41 51.5,40.7 52.07,40.13 66.8,40.13 73.91,33.02 75.69,33.02 77.72,30.99 81.79,30.99 82.55,30.23 82.55,18.7 RN8.6
  Bottom 0.406: X4.1 79.6,15.75 RN8.6
D54  (via drill 0.4)
  Top 0.305: v26.42,76.2 R2.1 | U1.97 45.5,61.18 45.21,61.47 39.62,61.47 29.72,71.37 25.15,71.37 24.13,72.39 24.13,76.96 23.37,77.72 23.37,81.63 X5.10
  Bottom 0.406: X5.10 15.75,88.14 22.86,81.03 22.86,77.47 24.13,76.2 v26.42,76.2
D55
  Top 0.305: U1.96 46,61.44 45.47,61.98 39.88,61.98 29.97,71.88 25.4,71.88 24.64,72.64 24.64,74.91 24.65,74.92 RN9.6
  Bottom 0.406: RN9.6 24.65,83.85 X5.9
D56
  Top 0.305: RN9.5 25.15,76.96 25.15,72.9 25.65,72.39 30.23,72.39 40.13,62.48 45.72,62.48 46.5,61.7 U1.95
  Bottom 0.406: RN9.5 27.19,84.81 X5.8
D57
  Top 0.305: U1.94 47,62.22 46.23,62.99 40.39,62.99 30.48,72.9 25.91,72.9 25.65,73.15 25.65,76.71 26.16,77.22 28.45,77.22 29.73,78.5 RN9.4
  Bottom 0.406: RN9.4 29.73,85.77 X5.7
D58
  Top 0.305: U1.93 47.5,62.48 46.48,63.5 40.64,63.5 37.34,66.8 37.34,75.18 35.31,77.22 34.05,77.22 RN9.3
  Bottom 0.406: RN9.3 32.27,86.73 X5.6
D59
  Top 0.305: RN9.2 35.05,78.24 37.85,75.44 37.85,67.06 38.35,66.55 38.48,66.42 40.89,64.01 46.74,64.01 48,62.74 U1.92
  Bottom 0.406: RN9.2 34.81,87.69 X5.5
D60  (via drill 0.4)
  Top 0.305: U1.91 48.5,63.01 46.99,64.52 41.15,64.52 38.35,67.31 38.35,76.2 v37.59,76.96
  Top 0.406: v35.81,75.44 34.8,75.44 34.48,75.76 R3.1
  Bottom 0.305: v37.59,76.96 36.07,76.96
  Bottom 0.406: X5.4 36.75,81.45 36.07,80.77 36.07,76.96 36.07,75.69 v35.81,75.44
D61
  Top 0.305: 47.69,70.36 R6.2 47.94,69.85 48.26,69.85 48.77,69.34 48.77,67.31 48.01,67.31 48.01,64.26 49,63.27 U1.90
D62
  Top 0.305: U1.89 49.5,62.96 51.56,65.02 59.69,65.02 61.21,66.55 61.21,69.34 60.45,70.1 59.62,70.1 R7.2
D63  (via drill 0.4)
  Top 0.305: X7.7 62.75,84.57 61.21,83.03 61.21,77.98 61.72,77.47 61.72,66.29 59.94,64.52 51.82,64.52 50,62.7 U1.88 | 65.79,76.27 R4.1
  Top 0.406: 65.85,76.77 R4.1 65.85,77.03 66.55,77.72 v66.55,80.77
  Bottom 0.406: v66.55,80.77 66.55,85.85 68.07,87.38 68.07,91.69 67.31,92.46 63.75,92.46 62.74,91.44 62.74,89.26 X7.7
D64
  Top 0.305: U1.87 50.5,62.44 52.07,64.01 60.2,64.01 62.48,66.29 62.48,76.29 RN10.2
  Bottom 0.406: RN10.2 65.19,88.19 X7.6
D65  (via drill 0.4)
  Top 0.305: U1.86 51,62.18 52.32,63.5 60.45,63.5 63.25,66.29 63.25,75.69 v64.26,76.71
  Bottom 0.305: v64.26,76.71 65.44,76.71 RN10.3
  Bottom 0.406: RN10.3 67.73,85.51 69.6,87.38 69.6,89.1 X7.5
D66  (via drill 0.4)
  Top 0.305: U1.85 51.5,61.91 52.58,62.99 60.71,62.99 64.01,66.29 64.01,73.41 v64.26,73.66
  Bottom 0.305: RN10.4 70.27,78.83 71.63,77.47 71.63,74.68 70.87,73.91 64.52,73.91 v64.26,73.66
  Bottom 0.406: RN10.4 70.27,86.27 X7.4
D67  (via drill 0.4)
  Top 0.305: U1.84 52,61.65 52.83,62.48 60.96,62.48 64.77,66.29 64.77,72.64 66.8,74.68 v72.64,74.68
  Bottom 0.305: v72.64,74.68 72.64,78.83 RN10.5
  Bottom 0.406: RN10.5 72.81,85.31 X7.3
D68
  Top 0.305: 52.5,59.18 U1.83 | 52.5,59.18 52.5,61.39 53.09,61.98 61.21,61.98 65.53,66.29 65.53,72.39 67.06,73.91 73.15,73.91 74.68,75.44 74.68,78.33 RN10.6 | 52.5,59.36 52.5,59.18
  Bottom 0.406: RN10.6 75.35,84.35 X7.2
D69  (via drill 0.4)
  Top 0.305: v73.66,76.2 R5.1 | U1.82 53,61.13 53.34,61.47 61.47,61.47 66.29,66.29 66.29,72.14 67.31,73.15 73.41,73.15 75.69,75.44 75.69,76.45 v75.75,76.52
  Bottom 0.406: X7.1 83.75,88.83 76.96,82.04 76.96,77.72 v75.75,76.52 75.44,76.2 v73.66,76.2
GND  (via drill 0.4)
  Top 0.305: R9.2 55.24,70.29 T2.E | 49.91,32.99 C1.1 | 49.91,32.99 C2.1 | C7.2 53.5,59.66 U1.81 53.5,53.5 v52.58,52.58 | C8.2 44.5,60.09 U1.99 44.5,60.03 v44.7,60.2 | C9.2 39.95,51.25 40.04,51.25 40.3,51 U1.11 52.27,51 52.58,50.69 v52.58,50.55 | 81.28,65.41 v81.15,65.66 81.03,65.53 81.03,80.01 79.38,81.66 v69.34,81.66 | U1.32 47,39.13 v46.61,38.73 | v50.04,31.62 50.04,32.87 49.91,32.99 | v55.12,49.02 55.6,49.5 U1.62 59.02,49.5 59.18,49.66 59.18,50.55 60.23,51.59 | v59.69,52.58 59.69,52.13 60.23,51.59 | 60.23,51.59 C6.2 | U$1.1 47.34,19.98 C11.1 | v22.86,31.24 28.96,31.24 29.21,30.99 | R13.1 46.55,3.75 46.67,3.87
  Top 0.406: v55.24,71.25 55.24,70.29 | v45.85,70.61 45.78,70.55 R8.2 T1.E 41.67,70.87 v40.39,70.87 | C15.2 51.18,66.17 v51.44,66.42 | C14.2 v49.91,71.12 | 55.78,21.4 C13.1 C12.1 C11.1 C10.1 44.96,20.26 C16.2 | 55.78,21.4 U$3.OUT-@1 | v56.72,25.73 55.93,25.73 v50.04,31.62 | 61.79,11.11 61.98,10.92 61.67,10.92 X6.1 | 51.69,4.95 55.5,4.95 56.65,3.8 U$3.IN-@1 57.66,4.74 57.66,7.62 56.96,8.32 C3.1 | 51.69,4.95 47.5,4.95 46.67,3.87 46.61,4.06 | R12.1 51.63,4.89 51.69,4.95 | R13.1 46.55,4.06 C4.1 44.01,6.6 43.18,6.6 40.78,9 J1.GND 35.16,9 33.53,7.37 30.99,7.37 29.21,9.14 29.21,30.99 29.21,31.24 33.78,35.81 35.69,35.81 ISP.6 | C17.2 55.95,16.32 56.64,17.02 56.64,20.54 55.78,21.4
  Bottom 0.305: SJ6.1 70.55,76.64 69.85,77.34 69.47,77.34 68.96,77.85 68.96,81.28 v69.34,81.66 | 80.58,63.94 80.77,64.14 80.77,65.28 v81.15,65.66 | SJ4.1 80.52,29.71 81.03,29.21 81.03,27.43 80.26,26.67 57.66,26.67 | v55.12,49.02 54.1,49.02 v52.58,50.55 v52.58,52.58 | v44.7,60.2 44.7,63.37 40.64,67.44 40.64,70.61 v40.39,70.87 | SJ2.1 22.78,30.14 v22.86,31.24 | 35.69,35.81 ISP.6
  Bottom 0.406: v59.69,52.58 59.18,52.58 | 51.05,67.06 51.05,66.8 | 51.05,67.06 v55.24,71.25 | 47.5,70.61 v45.85,70.61 | 47.5,70.61 51.05,67.06 | 59.18,58.67 59.44,58.42 75.44,58.42 77.47,60.45 80.01,60.45 81.28,61.72 81.28,63.24 80.58,63.94 SJ3.1 | SJ1.1 33.52,64 v40.39,70.87 36.58,70.87 32.54,74.9 SJ5.1 | v50.04,31.62 46.99,34.67 46.99,38.35 v46.61,38.73 | v49.91,71.12 48.01,71.12 47.5,70.61
  Bottom 0.813: X6.1 61.5,5.62 59.69,3.81 U$3.IN-@1 | 68.58,10.83 X6.3
  Bottom 1.016: 51.05,66.8 v51.44,66.42 59.18,58.67 59.18,52.58 59.18,28.19 57.66,26.67 v56.72,25.73 U$3.OUT-@1 60.21,22.34 64.77,17.78 64.77,14.48 | X6.1 61.5,13.24 62.74,14.48 64.77,14.48 | X6.3 68.5,13.03 67.06,14.48 64.77,14.48
MISO
  Top 0.305: ISP.1 40.89,39.12 38.99,41.02 38.99,44.96 39.53,45.5 U1.22
MOSI
  Top 0.305: ISP.4 39.62,36.96 39.62,39.37 38.35,40.64 38.35,45.09 39.27,46 U1.21
N$1  (via drill 4.2)
  other vias: 3.5,3.5
N$2  (via drill 4.2)
  other vias: 96.5,3.5
N$3  (via drill 4.2)
  other vias: 3.5,96.5
N$4  (via drill 4.2)
  other vias: 96.5,96.5
N$5
  Top 0.406: J1.D+ 31.13,9 30.73,9.4 30.73,11.68 32.26,13.21 42.42,13.21 43.94,14.73 47.22,14.73 U$1.5
N$6
  Bottom 0.406: RN2.1 SJ1.2 RN1.1
N$7
  Bottom 0.406: RN3.1 SJ2.2 RN4.1
N$8
  Top 0.406: J1.D- 32.75,11.16 34.04,12.45 42.93,12.45 43.69,13.21 47.22,13.21 U$1.6
N$9  (via drill 0.6)
  Top 0.61: v31.24,14.99 D1.P$2
  Bottom 0.61: J1.VBUS v31.24,14.99
N$10
  Bottom 0.406: RN6.1 SJ3.2 RN5.1
N$11
  Bottom 0.406: RN8.1 SJ4.2 RN7.1
N$12
  Top 0.406: U$1.7 47.47,11.94 48.51,11.94 52.86,7.59 XT2.1 54.1,7.37 55.05,6.42 C3.2
N$13
  Top 0.406: U$1.8 47.21,10.66 XT2.2 46.23,7.37 45.28,8.32 C4.2
N$14  (via drill 0.4)
  Top 0.406: U$1.13 51.44,15.88 v51.31,15.75 | v41.4,17.53 41.4,25.4 35.05,31.75 35.05,32.95 C5.1
  Bottom 0.406: v51.31,15.75 43.18,15.75 v41.4,17.53
N$15
  Top 0.305: U1.33 47.5,37.33 XT1.1 47.05,36.88
  Top 0.406: C1.2 46.8,36.62 47.05,36.88
N$16
  Top 0.305: U1.34 48,39.38 49.28,38.1 51.73,38.1 52.79,37.04 XT1.2 52.95,36.88
  Top 0.406: C2.2 53.2,36.62 52.79,37.04
N$17
  Top 0.406: D2.A 48.75,76.96 45.47,76.96 43.46,74.96 K1.9 39.91,74.96 39.12,74.17 39.12,70.27 T1.C 39.79,68.12 LED1.C
N$18  (via drill 0.4)
  Top 0.305: T2.C 51.73,67.61 LED2.C
  Top 0.406: v58.67,76.96 60.69,76.96 D3.A | T2.C 51.73,73.96 52.7,74.93 53.43,74.93 K2.9
  Bottom 0.406: K2.9 54.39,74.96 56.39,76.96 v58.67,76.96
N$19  (via drill 0.4)
  Top 0.305: R5.2 70.1,76.13 69.09,76.13 SJ6.2 67.82,76.13 R4.2
  Top 0.406: 62.65,79.92 RN10.1 62.65,80.18 64.26,81.79 67.82,81.79 69.09,80.52 69.09,76.13 | 69.09,76.19 SJ6.2
  other vias: 69.02,76.13
N$20  (via drill 0.4)
  Top 0.305: 29.4,76.39 R2.2 29.53,76.08 SJ5.2 | RN9.1 35.07,81.28 32,81.28 30.99,80.26 30.99,76.11 SJ5.2 | SJ5.2 32.44,76.08 R3.2
  other vias: 31.02,76.08
N$21
  Top 0.305: LED1.A R10.1
N$22
  Top 0.305: T2.B R9.1 R7.1
N$23
  Top 0.305: LED2.A R11.1
N$24
  Top 0.305: T1.B R8.1 R6.1
N$25
  Top 0.406: D13.C 53.63,3.2 R12.2
N$26  (via drill 0.4)
  Top 0.305: U1.26 44,41.5 43.5,41 43.5,40.96 v43.43,40.89
  Top 0.406: v50.04,3.3 50.04,2.03 50.8,1.27 D13.A
  Bottom 0.406: v43.43,40.89 43.43,28.7 40.13,25.4 40.13,17.27 50.04,7.37 v50.04,3.3
N$27
  Top 0.406: PWR.C 48.55,3.2 R13.2
N$28
  Top 0.406: U$1.4 45.41,15.88 C16.1
NC1
  Bottom 1.016: K1.1 47.42,72.42 49,74 49,86 47.25,87.75 X5.1
NC2
  Bottom 1.016: K2.1 59.42,72.42 61,74 61,86 59.5,87.5 59.5,89 X7.8
NO1
  Bottom 1.016: K1.10 40.58,72.42 39,74 39,86 40.5,87.5 40.5,89 X5.3
NO2
  Bottom 1.016: K2.10 52.58,72.42 51,74 51,86 52.5,87.5 X7.10
RST  (via drill 0.4)
  Top 0.305: U1.30 46,40.92 44.96,39.88 v42.42,39.88 | ISP.5 36.2,38.23 37.08,37.34 37.08,33.09 | 37.08,33.09 C5.2 | 37.08,33.09 39.37,33.09 R1.1
  Bottom 0.305: v42.42,39.88 37.47,39.88 ISP.5
SCK
  Top 0.305: ISP.3 37.72,38.86 37.72,45.21 39.01,46.5 U1.20
VCC  (via drill 0.4)
  Top 0.305: U1.80 54,58.95 54.19,59.14 55.14,59.14 C7.1 | C6.1 59.84,49 U1.61 56.87,49 56.64,48.77 56.64,48.26 v56.52,48.13 | U1.98 45,57.06 44.83,56.9 | 44.83,56.9 44.2,56.9 44,57.09 U1.100 43.6,58 42.42,59.18 C8.1 | C9.1 40.89,52.34 40.89,51.69 41.08,51.5 U1.10 46.23,51.5 | v75.69,29.97 v56.9,29.97 | v28.45,81.03 29.46,82.04 39.37,82.04 40.39,81.03 43.43,81.03 | v17.78,64.01 17.78,62.48 19.05,61.21 19.05,52.96 16.64,50.55 16.64,32.89 v18.67,30.86 | 44.83,56.9 45.21,56.9 46.23,55.88 46.23,51.5 | 46.23,51.5 54.92,51.5 54.93,51.51 55.83,51.51 v55.88,51.56 | U1.31 46.5,40.28 46.1,39.88 | R1.2 41.59,33.59 41.4,33.78 40.89,34.48 ISP.2 44.58,39.37 45.59,39.37 46.1,39.88 | 46.1,39.88 v46.1,39.75
  Top 0.406: C7.1 56.9,59.5 v56.9,59.18 57.15,59.44 v60.45,59.44 | R11.2 v59.94,66.55 | 43.43,81.03 v46.48,77.98 | v46.99,65.53 46.92,65.6 R10.2 | v49.15,64.77 49.09,64.83 C15.1 49.15,66.23 49.15,66.67 49.91,67.44 C14.1 | C13.2 C12.2 C11.2 C10.2 44.47,23.3 U$3.OUT+@2 | PWR.A 38.99,1.27 37.59,2.67 v37.59,7.87 | C17.1 53.66,19.68 U$1.16 51.44,19.68 v51.31,19.56
  Top 0.61: 50.07,74.96 51.31,76.2 57.3,76.2 K2.2 60.69,74.96 D3.C | 50.07,74.96 K1.2 | D2.C 50.05,74.95 50.07,74.96 | D1.P$1 v37.59,14.99 v37.6,14.99 41.66,14.99 42.93,16.26 42.93,21.59 43.51,22.18 U$3.OUT+@2
  Bottom 0.305: SJ4.3 75.72,30 v75.69,29.97 | v28.45,81.03 28.45,77.32 29.46,76.31 | 56.64,49.02 56.9,48.77 56.9,48.51 v56.52,48.13 | v55.88,51.56 56.9,51.56
  Bottom 0.406: 56.9,56.13 v56.9,59.18 | 65.02,64 SJ3.3 | 65.02,64 v60.45,59.44 | 65.02,64 62.47,66.55 v59.94,66.55 60.2,66.8 60.2,71.12 65.21,76.13 SJ6.3 | SJ1.3 v17.79,64 v17.78,64.01 17.78,66.55 18.54,67.31 22.86,67.31 29.46,73.91 29.46,76.31 SJ5.3 | v18.67,30.86 18.54,30.93 SJ2.3 | v46.48,77.98 46.48,74.93 | v46.1,39.75 56.9,39.75 | v46.99,65.53 46.99,65.02 | v49.15,64.77 48.7,64.33 | v37.59,7.87 v37.59,14.99 | v51.31,19.56 51.31,20.3 49.27,22.34
  Bottom 0.61: 48.01,65.02 46.99,65.02 45.97,65.02 43.69,67.31 43.69,73.15 45.47,74.93 46.48,74.93 46.51,74.93 K1.2
  Bottom 1.016: U$3.OUT+@2 49.27,22.34 v56.9,29.97 56.9,39.75 56.9,48.77 56.9,51.56 56.9,56.13 48.7,64.33 48.01,65.02
VIN
  Bottom 0.813: U$3.IN+@2 43.51,3.73 45.82,1.42 60.86,1.42 65.02,5.59 65.02,10.73 X6.2

### Text on the board
tPlace: D54 | D69 | NO | NC | NO | NC | D55 | D56 | D57 | D58 | D59 | D60 | D63 | D64 | D65 | D66 | D67 | D68 | COM | COM | D2 | D24 | D3 | D25 | D4 | D61 | D62 | D26 | D5 | D27 | D6 | D28 | D7 | D29 | D8 | D30 | D9 | D31 | D10 | D32 | D11 | D33 | D14 | D34 | D15 | D35 | D16 | D36 | D17 | D37 | D18 | D38 | D19 | D39 | D20 | D40 | D21 | D41 | D22 | D42 | D23 | D43 | GND | 9-28V | GND | USB | PWR | D13 | VIN
bPlace: + | - | + | - | + | - | + | - | + | - | + | -